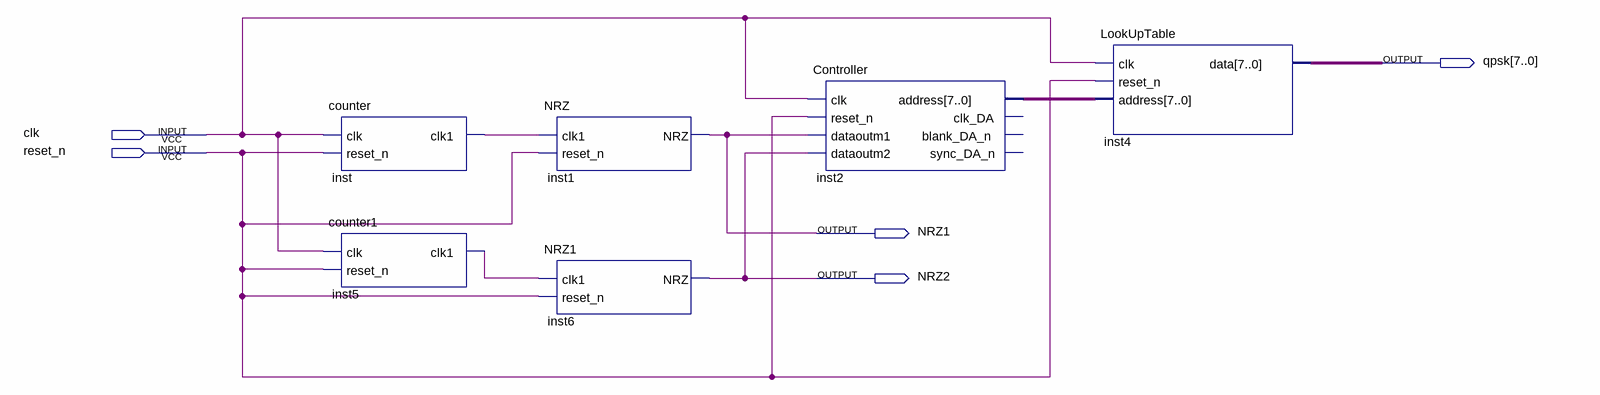
[diagram p0: schematic sheet]
// Quartus schematic qpsk.bdf as structural Verilog: 6 symbols, 5 pins
module qpsk (
  input  clk,
  input  reset_n,
  output [7:0] qpsk,
  output NRZ1,
  output NRZ2
);

  wire inst5_clk1, inst_clk1;
  wire [7:0] inst2_address;

  counter inst (.clk(clk), .reset_n(reset_n), .clk1(inst_clk1));
  counter1 inst5 (.clk(clk), .reset_n(reset_n), .clk1(inst5_clk1));
  NRZ inst1 (.clk1(inst_clk1), .reset_n(reset_n), .NRZ(NRZ1));
  NRZ1 inst6 (.clk1(inst5_clk1), .reset_n(reset_n), .NRZ(NRZ2));
  Controller inst2 (
    .clk(clk), .reset_n(reset_n), .dataoutm1(NRZ1), .dataoutm2(NRZ2), .address(inst2_address));  // open: clk_DA, blank_DA_n, sync_DA_n
  LookUpTable inst4 (.clk(clk), .reset_n(reset_n), .address(inst2_address), .data(qpsk));
endmodule
